# EAGLE design schema (EAGLE 9.5.2)
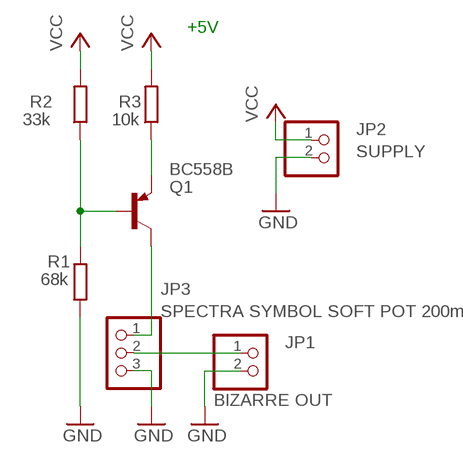
[diagram p0: schematic, sheet 1]

## Parts
JP1  BIZARRE OUT  PINHD-1X2  [1X02]
JP2  SUPPLY  PINHD-1X2  [1X02]
JP3  SPECTRA SYMBOL SOFT POT 200mm  PINHD-1X3  [1X03]
Q1  BC558B  [TO92-EBC]
R1  68k  R-EU_0309/10  [0309/10]
R2  33k  R-EU_0309/10  [0309/10]
R3  10k  R-EU_0309/10  [0309/10]

## Nets
GND: JP1.2 JP2.2 JP3.3 R1.1
N$1: Q1.B R1.2 R2.1
N$2: Q1.E R3.1
N$3: JP3.1 Q1.C
N$4: JP1.1 JP3.2
VCC: JP2.1 R2.2 R3.2

## Notes on the sheet
- +5V

## Library data of the parts
JP1 JP2 = pinhead:PINHD-1X2: PIN HEADER
JP3 = pinhead:PINHD-1X3: PIN HEADER
Q1 = transistor-pnp:BC558*: PNP Transistror
R1-R3 = rcl:R-EU_: RESISTOR, European symbol; SPICEPREFIX: R

## Board
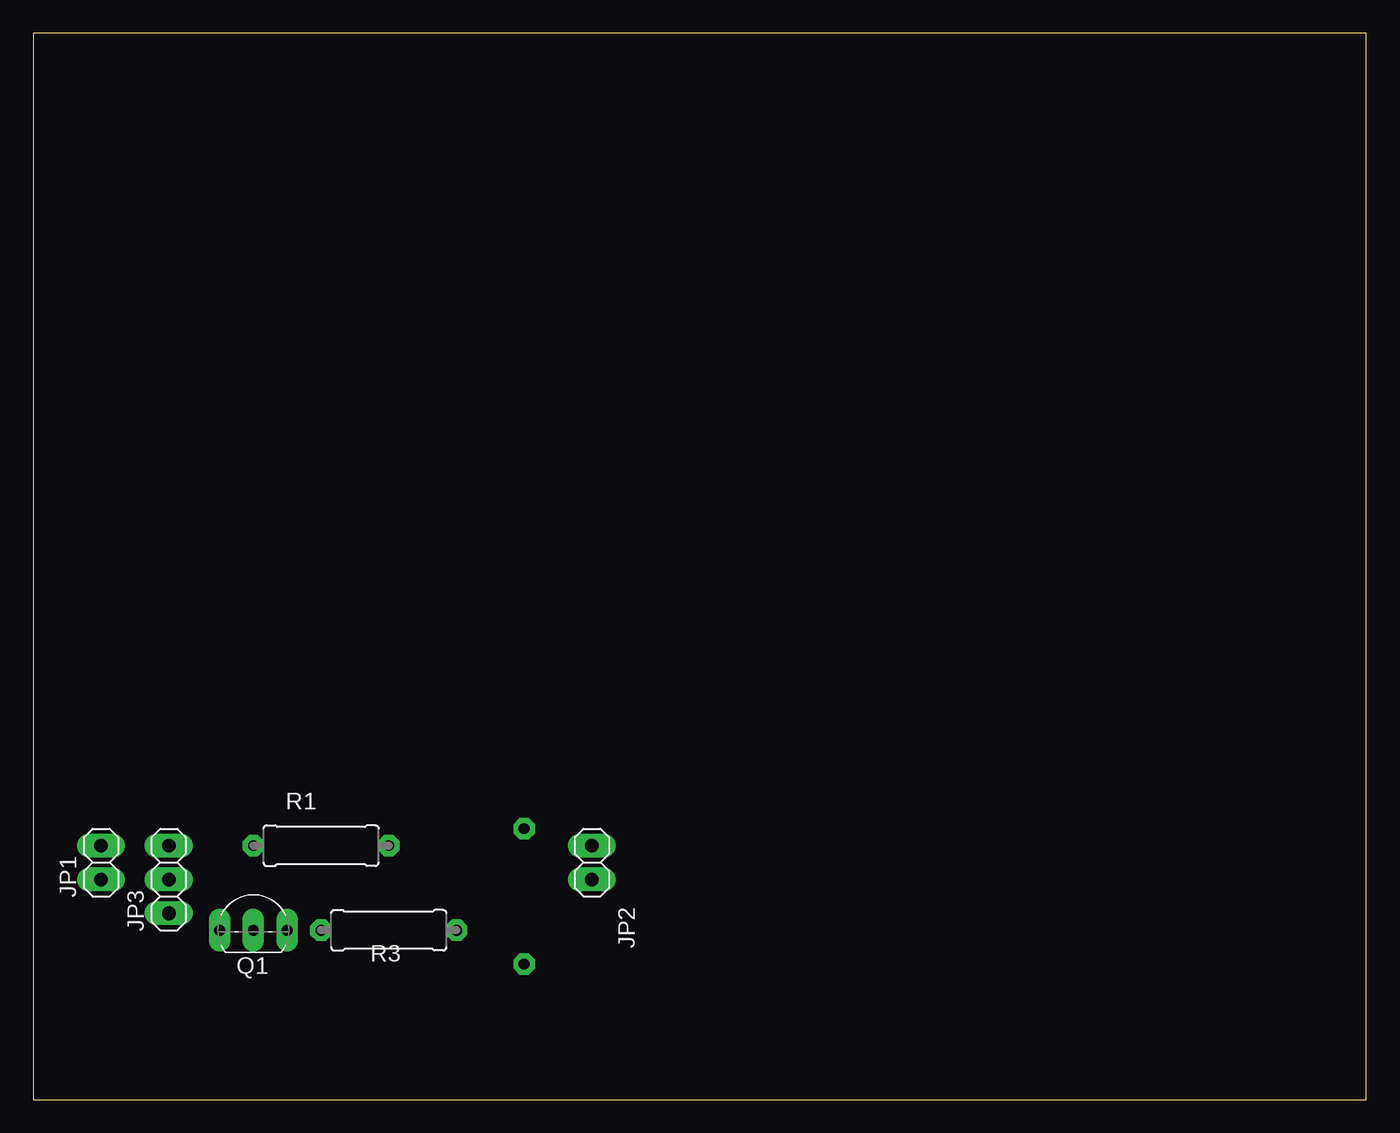
[diagram p1: board, top side]
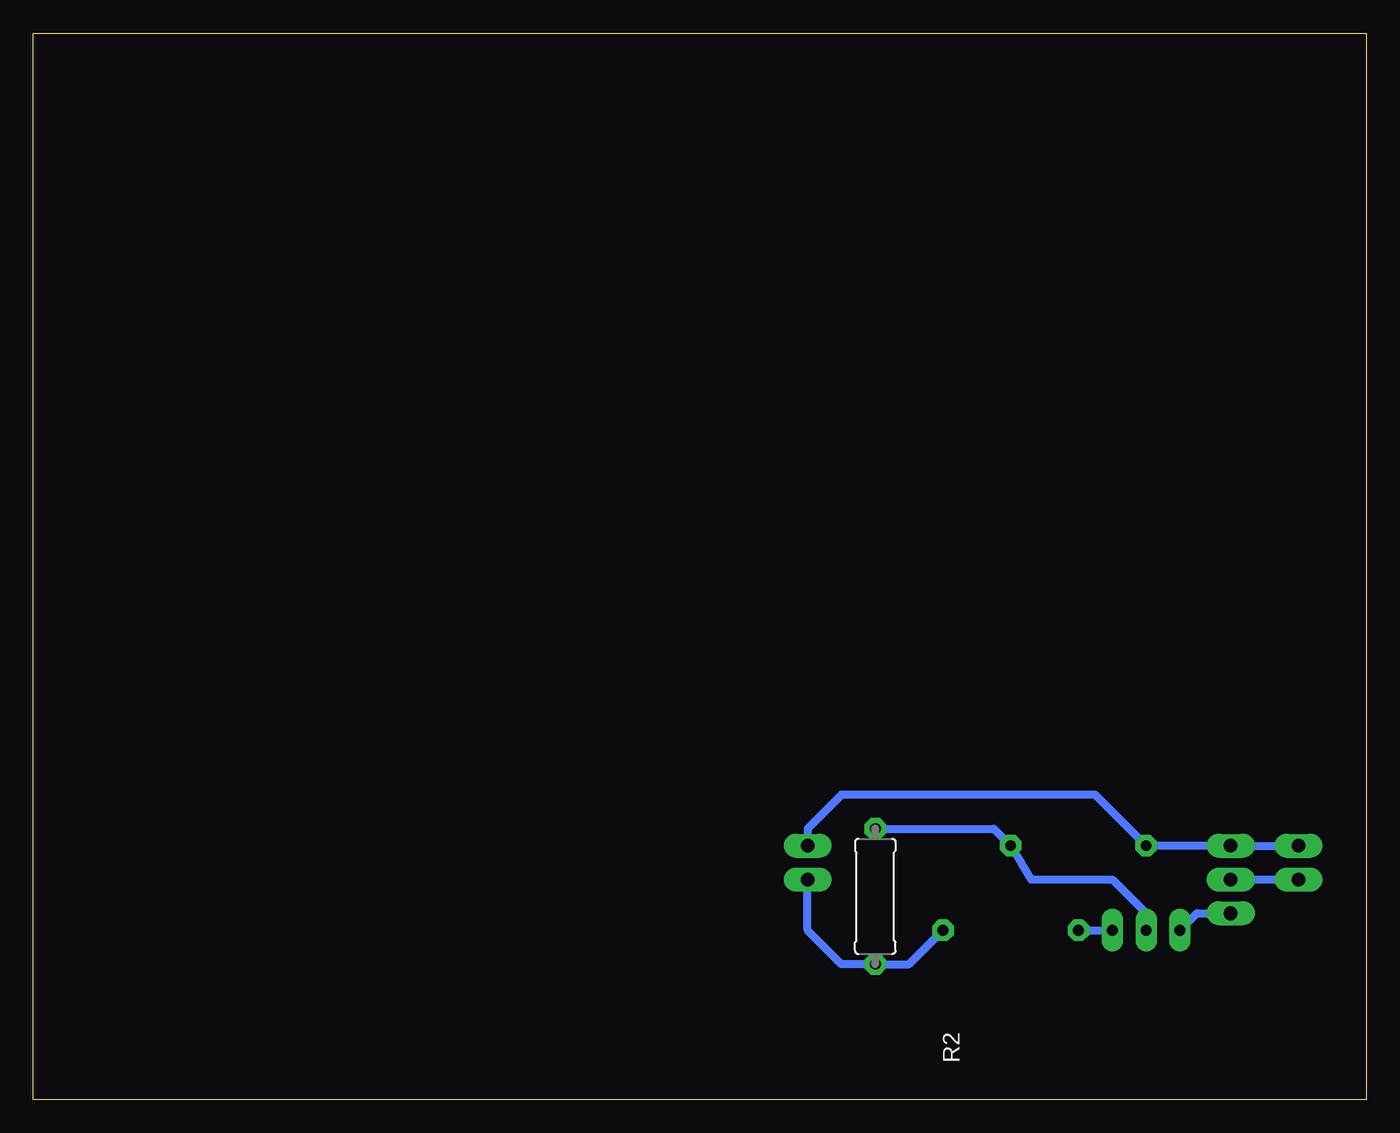
[diagram p2: board, bottom side, seen from below]

Size 100 x 80 mm. Coordinates in mm from the lower left corner, seen from the top.
Outline: 0,0 100,0 100,80 0,80 0,0
Copper layers (1*16): Top 0.035mm / dielectric 1.5mm / Bottom 0.035mm
Design rules "ENSEA_2019": minimum track width 0.4mm, minimum drill 0.6mm, track to track 0.4mm, track to pad 0.4mm, pad to pad 0.4mm, via to via 0.4mm, smd to smd 0.4mm, copper to edge 1mm, drill to drill 0.4mm, minimum pad ring 0.4mm, minimum via ring 0.4mm, stop-mask expansion 4mil, vias tented up to drill 0mil, thermal gap 0.4mm

### Footprints (pad centres in the part's own frame; a part is rotated, then mirrored left to right if it is on the bottom)
1X02 = drill 1.016 long: 1 -1.27,0; 2 1.27,0
1X03 = drill 1.016 long: 1 -2.54,0; 2 0,0; 3 2.54,0
TO92-EBC = drill 0.813 long: B 0,-1.27; C -2.54,-1.27; E 2.54,-1.27
0309/10 = drill 0.813 octagon: 1 -5.08,0; 2 5.08,0

### Placement (x,y rotation side)
JP1  5.08,17.78 90 top
JP2  41.91,17.78 90 top
JP3  10.16,16.51 90 top
Q1  16.51,13.97 0 top
R1  21.59,19.05 0 top
R2  36.83,15.24 270 bottom
R3  26.67,12.7 0 top

### Tracks (layer width: path | path; a pad name or v marks a point on that pad's centre or on a via)
GND
  Bottom 0.61: JP1.2 JP3.3 R1.1 20.32,22.86 39.37,22.86 41.91,20.32 JP2.2
N$1
  Bottom 0.61: Q1.B 16.51,13.97 19.05,16.51 25.15,16.51 R1.2 27.94,20.32 R2.1
N$2
  Bottom 0.61: R3.1 Q1.E
N$3
  Bottom 0.61: JP3.1 12.7,13.97 Q1.C
N$4
  Bottom 0.61: JP3.2 JP1.1
VCC
  Bottom 0.61: R3.2 34.29,10.16 R2.2 39.37,10.16 41.91,12.7 JP2.1